# EasyEDA Pro project stm32手表_2024-06-10.epro, schematic STM32手表v2.0
Create Date: 2024-03-20; Page Name: P1; Project Name: stm32手表; Schematic Name: Schematic1; Update Date: 2024-06-09; Company: 嘉立创EDA; Page Size: A4; Version: V1.0
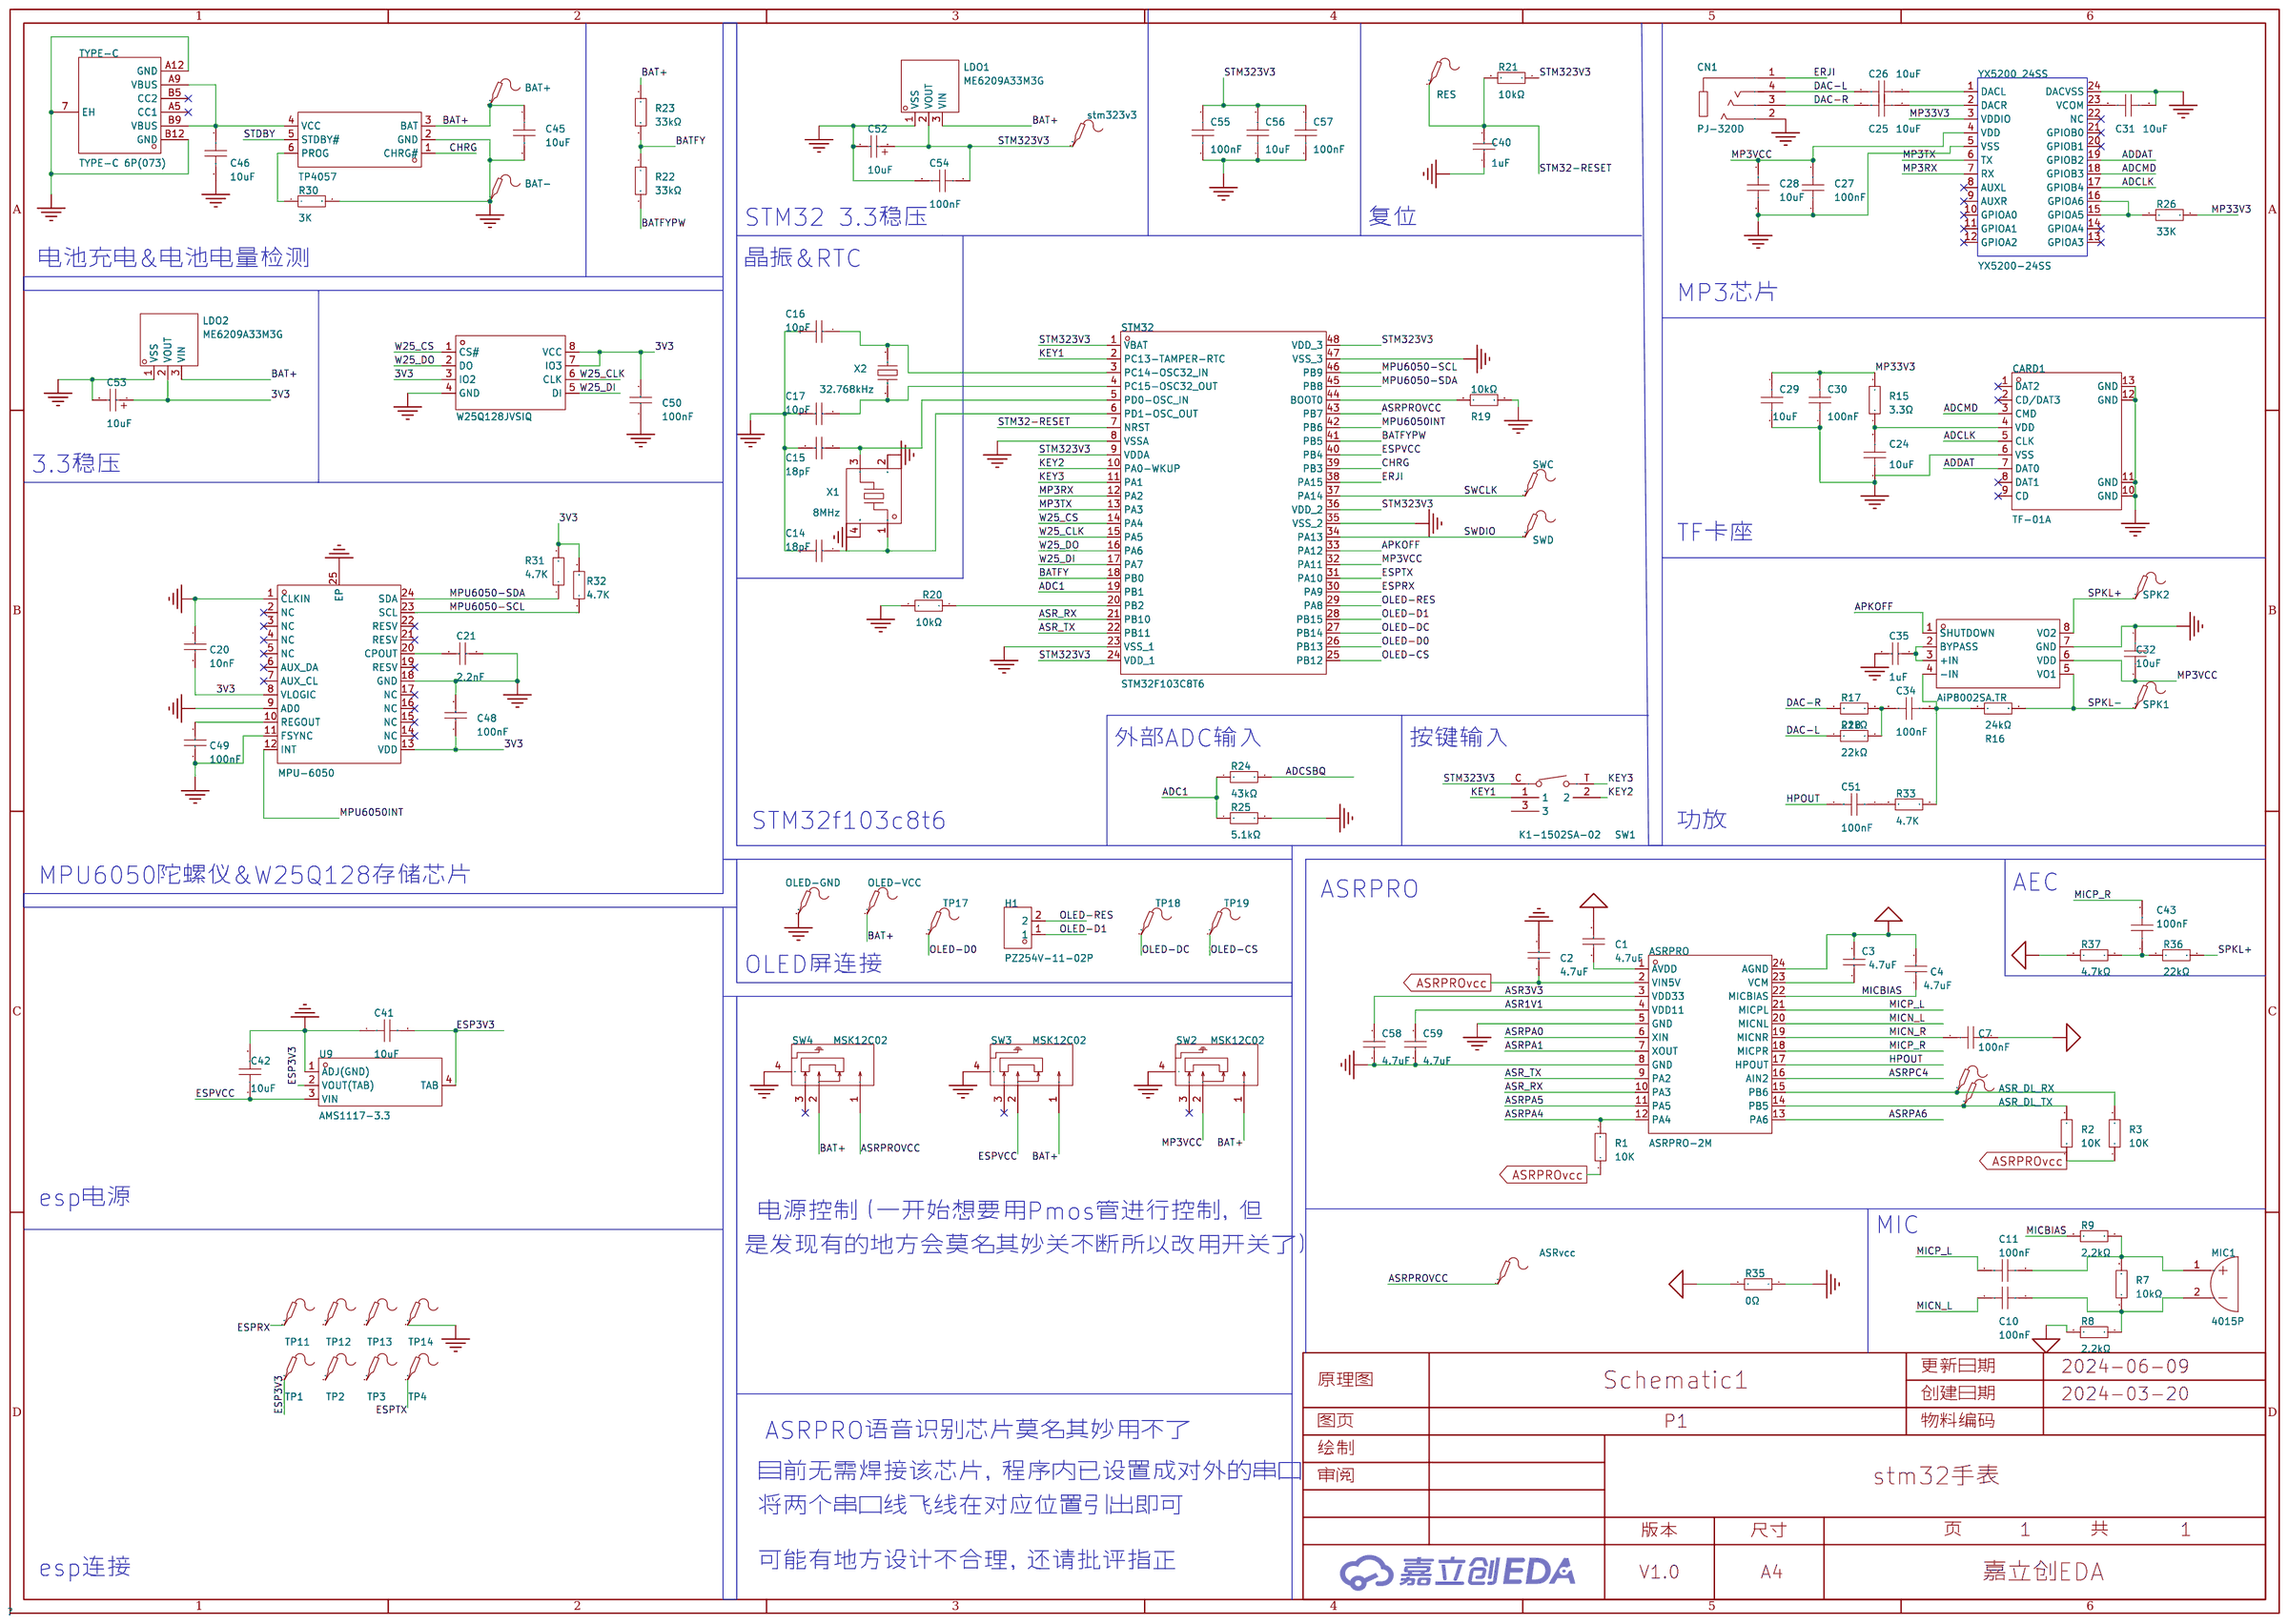
[diagram p0: schematic sheet]

## Parts
8002A  AiP8002SA.TR  [SOP-8_L4.9-W3.9-P1.27-LS6.0-BL]
ASR_DL_RX  -  [Test-Point-0.5mm]
ASR_DL_TX  -  [Test-Point-0.5mm]
ASRPRO  ASRPRO-2M  [SSOP-24_L8.7-W3.9-P0.64-LS6.0-BL-1]
ASRvcc  -  [Test-Point-0.5mm]
BAT+  -  [Test-Point-0.5mm]
BAT-  -  [Test-Point-0.5mm]
C1  4.7uF  [C0603]
C2  4.7uF  [C0603]
C3  4.7uF  [C0603]
C4  4.7uF  [C0603]
C7  100nF  [C0603]
C10  100nF  [C0603]
C11  100nF  [C0603]
C14  18pF  [C0603]
C15  18pF  [C0603]
C16  10pF  [C0603]
C17  10pF  [C0603]
C20  10nF  [C0603]
C21  2.2nF  [C0603]
C24  10uF  [C0603]
C25  10uF  [C0603]
C26  10uF  [C0603]
C27  100nF  [C0603]
C28  10uF  [C0603]
C29  10uF  [C0603]
C30  100nF  [C0603]
C31  10uF  [C0603]
C32  10uF  [C0603]
C34  100nF  [C0603]
C35  1uF  [C0603]
C40  1uF  [C0603]
C41  10uF  [C0603]
C42  10uF  [C0603]
C43  100nF  [C0603]
C45  10uF  [C0603]
C46  10uF  [C0603]
C48  100nF  [C0603]
C49  100nF  [C0603]
C50  100nF  [C0603]
C51  100nF  [C0603]
C52  10uF  [CASE-A_3216]
C53  10uF  [CASE-A_3216]
C54  100nF  [C0603]
C55  100nF  [C0603]
C56  10uF  [C0603]
C57  100nF  [C0603]
C58  4.7uF  [C0603]
C59  4.7uF  [C0603]
CARD1  TF-01A  [TF-SMD_TF-02]
CN1  PJ-320D  [AUDIO-SMD_PJ-320D]
H1  PZ254V-11-02P  [HDR-TH_2P-P2.54-V-M]
LDO1  ME6209A33M3G  [SOT-23-3_L2.9-W1.6-P1.90-LS2.8-BR]
LDO2  ME6209A33M3G  [SOT-23-3_L2.9-W1.6-P1.90-LS2.8-BR]
MIC1  4015P  [MIC-TH_BD4.0-P1.40-D0.4-L-FD]
MPU-6050  MPU-6050  [QFN-24_L4.0-W4.0-P0.50-BL-EP2.7]
OLED-GND  -  [Test-Point-0.5mm]
OLED-VCC  -  [Test-Point-0.5mm]
R1  10K  [R0603]
R2  10K  [R0603]
R3  10K  [R0603]
R7  10kΩ  [R0603]
R8  2.2kΩ  [R0603]
R9  2.2kΩ  [R0603]
R15  3.3Ω  [R0603]
R16  24kΩ  [R0603]
R17  22kΩ  [R0603]
R18  22kΩ  [R0603]
R19  10kΩ  [R0603]
R20  10kΩ  [R0603]
R21  10kΩ  [R0603]
R22  33kΩ  [R0603]
R23  33kΩ  [R0603]
R24  43kΩ  [R0603]
R25  5.1kΩ  [R0603]
R26  33K  [R0603]
R30  3K  [R0603]
R31  4.7K  [R0603]
R32  4.7K  [R0603]
R33  4.7K  [R0603]
R35  0Ω  [R0402]
R36  22kΩ  [R0603]
R37  4.7kΩ  [R0603]
RES  -  [Test-Point-0.5mm]
SPK1  -  [Test-Point-0.5mm]
SPK2  -  [Test-Point-0.5mm]
STM32  STM32F103C8T6  [LQFP-48_L7.0-W7.0-P0.50-LS9.0-BL]
stm323v3  -  [Test-Point-0.5mm]
SW1  K1-1502SA-02  [KEY-SMD_K1-1502SA-02]
SW2  MSK12C02  [SW-TH_MSK12C02]
SW3  MSK12C02  [SW-TH_MSK12C02]
SW4  MSK12C02  [SW-TH_MSK12C02]
SWC  -  [Test-Point-0.5mm]
SWD  -  [Test-Point-0.5mm]
TP1  -  [Test-Point-0.5mm]
TP2  -  [Test-Point-0.5mm]
TP3  -  [Test-Point-0.5mm]
TP4  -  [Test-Point-0.5mm]
TP11  -  [Test-Point-0.5mm]
TP12  -  [Test-Point-0.5mm]
TP13  -  [Test-Point-0.5mm]
TP14  -  [Test-Point-0.5mm]
TP17  -  [Test-Point-0.5mm]
TP18  -  [Test-Point-0.5mm]
TP19  -  [Test-Point-0.5mm]
TP4057  TP4057  [SOT-23-6_L2.9-W1.6-P0.95-LS2.8-BR]
TYPE-C  TYPE-C 6P(073)  [TYPE-C-SMD_TYPE-C-6P]
U9  AMS1117-3.3  [SOT-223-4_L6.5-W3.5-P2.30-LS7.0-BR]
W25Q128  W25Q128JVSIQ  [SOIC-8_L5.3-W5.3-P1.27-LS8.0-BL]
X1  8MHz  [CRYSTAL-SMD_4P-L3.2-W2.5-BL]
X2  32.768kHz  [OSC-SMD_L3.2-W1.5]
YX5200_24SS  YX5200-24SS  [SSOP-24_L8.2-W5.3-P0.65-LS7.8-BL]

## Library data of the parts
8002A = AiP8002SA.TR: LCSC Part Name: 带关断模式的2W音频功率放大器; Supplier Part: C5162257; Manufacturer: I-CORE(中微爱芯); Supplier Footprint: SOP-8; JLCPCB Part Class: 扩展库; Datasheet: https://atta.szlcsc.com/upload/public/pdf/source/20220915/34DFDD2E4A18841713C467EC6A02930C.pdf; Supplier: LCSC
ASR_DL_RX ASR_DL_TX ASRvcc BAT+ BAT- OLED-GND OLED-VCC RES SPK1 SPK2 stm323v3 SWC SWD TP1-TP4 TP11-TP14 TP17-TP19 = Test-Point: Test Point 测试点
ASRPRO = ASRPRO-2M: Supplier Part: C9900044331; Supplier Footprint: SSOP24-0.635-8.65X4MM; JLCPCB Part Class: 扩展库; Supplier: LCSC
C1-C4 C58 C59 = CL10A475KP8NNNC: 容值:4.7uF;精度:±10%;额定电压:10V;材质(温度系数):X5R;; LCSC Part Name: 4.7uF ±10% 10V; Supplier Part: C1705; Manufacturer: SAMSUNG(三星); Supplier Footprint: 0603; JLCPCB Part Class: 扩展库; Datasheet: https://atta.szlcsc.com/upload/public/pdf/source/20160218/1457707763339.pdf; Supplier: LCSC; Tolerance: ±10%; Voltage Rated: 10V; Temperature Coefficient: X5R
C7 C10 C11 C27 C30 C34 C43 C51 = CC0603KRX7R9BB104: 容值:100nF;精度:±10%;额定电压:50V;材质(温度系数):X7R;; LCSC Part Name: 100nF ±10% 50V; Supplier Part: C14663; Manufacturer: YAGEO(国巨); Supplier Footprint: 0603; JLCPCB Part Class: 基础库; Datasheet: https://atta.szlcsc.com/upload/public/pdf/source/20180910/C282072_33301C7F631E79921B82A8DAC6BCC5B3.pdf; Supplier: LCSC; Tolerance: ±10%; Voltage Rated: 50V; Temperature Coefficient: X7R
C14 C15 = 0402CG220J500NT: 容值:22pF;精度:±5%;额定电压:50V;材质(温度系数):C0G;; LCSC Part Name: 22pF ±5% 50V; Supplier Part: C1555; Manufacturer: FH(风华); Supplier Footprint: 0402; JLCPCB Part Class: 基础库; Datasheet: https://atta.szlcsc.com/upload/public/pdf/source/20200305/C486355_26A10D38EF8C2A5C37091D0039909270.pdf; Supplier: LCSC; Tolerance: ±5%; Voltage Rated: 50V; Temperature Coefficient: C0G
C16 C17 = CC0603JRNPO9BN220: 容值:22pF;精度:±5%;额定电压:50V;材质(温度系数):NP0;; LCSC Part Name: 22pF ±5% 50V; Supplier Part: C105620; Manufacturer: YAGEO(国巨); Supplier Footprint: 0603; JLCPCB Part Class: 扩展库; Datasheet: https://atta.szlcsc.com/upload/public/pdf/source/20170505/1493957838062.pdf; Supplier: LCSC; Tolerance: ±5%; Voltage Rated: 50V; Temperature Coefficient: NP0
C20 C48-C50 = CC0603KRX7R9BB103: 容值:10nF;精度:±10%;额定电压:50V;材质(温度系数):X7R;; LCSC Part Name: 10nF ±10% 50V; Supplier Part: C100042; Manufacturer: YAGEO(国巨); Supplier Footprint: 0603; JLCPCB Part Class: 扩展库; Datasheet: https://atta.szlcsc.com/upload/public/pdf/source/20181008/C309510_22F155564471FAF6A489F7D68F34234E.pdf; Supplier: LCSC; Tolerance: ±10%; Voltage Rated: 50V; Temperature Coefficient: X7R
C21 = 0603B222K500NT: 容值:2.2nF;精度:±10%;额定电压:50V;材质(温度系数):X7R;; LCSC Part Name: 2.2nF ±10% 50V; Supplier Part: C1604; Manufacturer: FH(风华); Supplier Footprint: 0603; JLCPCB Part Class: 基础库; Datasheet: https://atta.szlcsc.com/upload/public/pdf/source/20200305/C486355_26A10D38EF8C2A5C37091D0039909270.pdf; Supplier: LCSC; Tolerance: ±10%; Voltage Rated: 50V; Temperature Coefficient: X7R
C24-C26 C28 C29 C31 C32 C41 C42 C45 C46 = CL10A106MQ8NNNC: 容值:10uF;精度:±20%;额定电压:6.3V;材质(温度系数):X5R;; LCSC Part Name: 10uF ±20% 6.3V; Supplier Part: C1691; Manufacturer: SAMSUNG(三星); Supplier Footprint: 0603; JLCPCB Part Class: 扩展库; Datasheet: https://atta.szlcsc.com/upload/public/pdf/source/20160218/1457707763339.pdf; Supplier: LCSC; Tolerance: ±20%; Voltage Rated: 6.3V; Temperature Coefficient: X5R
C35 C40 = CL10A105KB8NNNC: 容值:1uF;精度:±10%;额定电压:50V;材质(温度系数):X5R;; LCSC Part Name: 1uF ±10% 50V; Supplier Part: C15849; Manufacturer: SAMSUNG(三星); Supplier Footprint: 0603; JLCPCB Part Class: 基础库; Datasheet: https://atta.szlcsc.com/upload/public/pdf/source/20160218/1457707763339.pdf; Supplier: LCSC; Tolerance: ±10%; Voltage Rated: 50V; Temperature Coefficient: X5R
C52 C53 = TAJA106K010RNJ: 容值:10uF;精度:±10%;额定电压:10V;等效串联电阻:3Ω@100kHz;; LCSC Part Name: 10uF ±10% 10V; Supplier Part: C7177; Manufacturer: Kyocera AVX; Supplier Footprint: CASE-A-3216; JLCPCB Part Class: 扩展库; Datasheet: https://atta.szlcsc.com/upload/public/pdf/source/20160107/1457707750344.pdf; Supplier: LCSC; Tolerance: ±10%; Rated Voltage: 10V; Equivalent Series Resistance(ESR): 3Ω@100kHz; Operating Temperature: -55℃~+125℃
C54-C57 = CAP_0603: Supplier Footprint: 0603
CARD1 = TF-01A_C2889258: 卡连接方式:自弹式;卡类型:MicroSD卡(TF卡);连接器类型:卡座;本体最大高度:2mm;工作温度范围:-;; LCSC Part Name: 自弹式 MicroSD卡(TF卡) 卡座; Supplier Part: C2889258; Manufacturer: Yuandi(元迪); Supplier Footprint: SMD; JLCPCB Part Class: 扩展库; Datasheet: https://atta.szlcsc.com/upload/public/pdf/source/20210830/44259D2B93BF4B637A446EF1520C4989.pdf; Supplier: LCSC; Card Connection Mode: 自弹式; Card Type: MicroSD卡(TF卡); Connector Type: 卡座; Maximum Body Height: 2mm
CN1 = PJ-320D_C431535: 连接器类型:3.5mm耳机座;额定电流:300mA;额定电压:50V;工作温度范围:-16℃~+65℃;; LCSC Part Name: 3.5mm耳机座; Supplier Part: C431535; Manufacturer: SHOU HAN(首韩); Supplier Footprint: SMD; JLCPCB Part Class: 扩展库; Datasheet: https://atta.szlcsc.com/upload/public/pdf/source/20190925/C431535_8B274506621F6117FB020BF07A197848.pdf; Supplier: LCSC; Connector Type: 3.5mm耳机座; Current Rating (Max): 300mA; Voltage Rating (Max): 50V; Operating Temperature Range: -16℃~+65℃
H1 = PZ254V-11-02P: 插针结构:1x2P;间距:2.54mm;行距:-;圆针/方针:方针;安装类型:直插;排数:单排;总PIN位数:2P;额定电流:-;额定电压:-;配合针长度:6mm;塑高:2.5mm;端接针长度:3mm;触头材质:黄铜;触头镀层:-;工作温度范围:-40℃~+105℃;颜色:黑色;; LCSC Part Name: 间距:2.54mm 1x2P 直插 方针; Supplier Part: C492401; Manufacturer: XFCN(兴飞); Supplier Footprint: 插件,P=2.54mm; JLCPCB Part Class: 扩展库; Datasheet: https://atta.szlcsc.com/upload/public/pdf/source/20200309/C492401_A812433581A9B211A7FFA413ADDFF0E5.pdf; Supplier: LCSC; Pin Structure: 1x2P; Pitch: 2.54mm; Circluar Pins/Square Pins: 方针; Mounting Type: 直插; Number of Rows: 单排; Number of Pins: 2P; Length of Mating Pin: 6mm; Insulation Height: 2.5mm; Length of End Connection Pin: 3mm; Contact Material: 黄铜; Operating Temperature Range: -40℃~+105℃; Color: 黑色
LDO1 LDO2 = ME6209A33M3G: 输出类型:固定;最大输入电压:18V;输出电压:3.3V;最大输出电流:250mA;电源纹波抑制比(PSRR):-;输出极性:正极;; LCSC Part Name: 输入18V 输出3.3V 250mA; Supplier Part: C83508; Manufacturer: MICRONE(南京微盟); Supplier Footprint: SOT-23-3L; JLCPCB Part Class: 扩展库; Datasheet: https://atta.szlcsc.com/upload/public/pdf/source/20161212/1481539101152.pdf; Supplier: LCSC; Output Type: 固定; Maximum Input Voltage: 18V; Output Voltage: 3.3V; MAX Output Current: 250mA; Dropout Voltage: 80mV@(40mA); Output Polarity: 正极; Number of Outputs: 1
MIC1 = GMI4015P-2C-42db: LCSC Part Name: 全指向双电容φ4.0*1.5mm 1.5V-10V 灵敏度-42dB 低阻抗; Supplier Part: C233292; Manufacturer: INGHAi(赢海); Supplier Footprint: 插件,D=4mm; JLCPCB Part Class: 扩展库; Datasheet: https://atta.szlcsc.com/upload/public/pdf/source/20180613/C233304_D8FE5A0D9DC594913DFA1A209BBF4764.pdf; Supplier: LCSC
MPU-6050 = MPU-6050: 传感器类型:加速度计陀螺仪;; Supplier Part: C24112; Manufacturer: TDK InvenSense(应美盛); Supplier Footprint: QFN-24-EP(4x4); JLCPCB Part Class: 扩展库; Datasheet: https://atta.szlcsc.com/upload/public/pdf/source/20140425/1457707046159.pdf; Supplier: LCSC; Sensor Type: 加速度计陀螺仪; Operating Temperature: -40℃~+85℃
R1-R3 R26 R30-R33 = Res_0603: Supplier Footprint: 0603
R7 R21 R24 = 0603WAF1002T5E: 电阻类型:厚膜电阻;阻值:10kΩ;精度:±1%;功率:100mW;最大工作电压:75V;温度系数:±100ppm/℃;; LCSC Part Name: 厚膜电阻 10kΩ ±1% 100mW; Supplier Part: C25804; Manufacturer: UNI-ROYAL(厚声); Supplier Footprint: 0603; JLCPCB Part Class: 基础库; Datasheet: https://atta.szlcsc.com/upload/public/pdf/source/20200306/C422600_1E6D84923E4A46A82E41ADD87F860B5C.pdf; Supplier: LCSC; Type: 厚膜电阻; Tolerance: ±1%; Power(Watts): 100mW; Overload Voltage (Max): 75V; Temperature Coefficient: ±100ppm/℃; Operating Temperature Range: -55℃~+155℃
R8 R9 R37 = 0603WAF2201T5E: 电阻类型:厚膜电阻;阻值:2.2kΩ;精度:±1%;功率:100mW;最大工作电压:75V;温度系数:±100ppm/℃;; LCSC Part Name: 2.2kΩ ±1% 100mW 厚膜电阻; Supplier Part: C4190; Manufacturer: UNI-ROYAL(厚声); Supplier Footprint: 0603; JLCPCB Part Class: 基础库; Datasheet: https://atta.szlcsc.com/upload/public/pdf/source/20200306/C422600_1E6D84923E4A46A82E41ADD87F860B5C.pdf; Supplier: LCSC; Type: 厚膜电阻; Tolerance: ±1%; Power(Watts): 100mW; Overload Voltage (Max): 75V; Temperature Coefficient: ±100ppm/℃; Operating Temperature Range: -55℃~+155℃
R15 = 0603WAF470KT5E: 电阻类型:厚膜电阻;阻值:4.7Ω;精度:±1%;功率:100mW;最大工作电压:75V;温度系数:±400ppm/℃;; LCSC Part Name: 4.7Ω ±1% 100mW 厚膜电阻; Supplier Part: C23164; Manufacturer: UNI-ROYAL(厚声); Supplier Footprint: 0603; JLCPCB Part Class: 基础库; Datasheet: https://atta.szlcsc.com/upload/public/pdf/source/20200306/C422600_1E6D84923E4A46A82E41ADD87F860B5C.pdf; Supplier: LCSC; Type: 厚膜电阻; Tolerance: ±1%; Power(Watts): 100mW; Overload Voltage (Max): 75V; Temperature Coefficient: ±400ppm/℃; Operating Temperature Range: -55℃~+155℃
R16 = 0603WAF2402T5E: 电阻类型:厚膜电阻;阻值:24kΩ;精度:±1%;功率:100mW;最大工作电压:75V;温度系数:±100ppm/℃;; LCSC Part Name: 24kΩ ±1% 100mW 厚膜电阻; Supplier Part: C23352; Manufacturer: UNI-ROYAL(厚声); Supplier Footprint: 0603; JLCPCB Part Class: 基础库; Datasheet: https://atta.szlcsc.com/upload/public/pdf/source/20200306/C422600_1E6D84923E4A46A82E41ADD87F860B5C.pdf; Supplier: LCSC; Type: 厚膜电阻; Tolerance: ±1%; Power(Watts): 100mW; Overload Voltage (Max): 75V; Temperature Coefficient: ±100ppm/℃; Operating Temperature Range: -55℃~+155℃
R17 R18 R36 = 0603WAF2202T5E: 电阻类型:厚膜电阻;阻值:22kΩ;精度:±1%;功率:100mW;最大工作电压:75V;温度系数:±100ppm/℃;; LCSC Part Name: 22kΩ ±1% 100mW 厚膜电阻; Supplier Part: C31850; Manufacturer: UNI-ROYAL(厚声); Supplier Footprint: 0603; JLCPCB Part Class: 基础库; Datasheet: https://atta.szlcsc.com/upload/public/pdf/source/20200306/C422600_1E6D84923E4A46A82E41ADD87F860B5C.pdf; Supplier: LCSC; Type: 厚膜电阻; Tolerance: ±1%; Power(Watts): 100mW; Overload Voltage (Max): 75V; Temperature Coefficient: ±100ppm/℃; Operating Temperature Range: -55℃~+155℃
R19 R20 = RC0603FR-07100KL: 电阻类型:厚膜电阻;阻值:100kΩ;精度:±1%;功率:100mW;最大工作电压:75V;温度系数:±100ppm/℃;; LCSC Part Name: 厚膜电阻 100kΩ ±1% 100mW; Supplier Part: C14675; Manufacturer: YAGEO(国巨); Supplier Footprint: 0603; JLCPCB Part Class: 扩展库; Datasheet: https://atta.szlcsc.com/upload/public/pdf/source/20140324/1457707028752.pdf; Supplier: LCSC; Type: 厚膜电阻; Tolerance: ±1%; Power(Watts): 100mW; Overload Voltage (Max): 75V; Temperature Coefficient: ±100ppm/℃; Operating Temperature Range: -55℃~+155℃
R22 R23 = 0603WAF4701T5E: 电阻类型:厚膜电阻;阻值:4.7kΩ;精度:±1%;功率:100mW;最大工作电压:75V;温度系数:±100ppm/℃;; LCSC Part Name: 4.7kΩ ±1% 100mW 厚膜电阻; Supplier Part: C23162; Manufacturer: UNI-ROYAL(厚声); Supplier Footprint: 0603; JLCPCB Part Class: 基础库; Datasheet: https://atta.szlcsc.com/upload/public/pdf/source/20200306/C422600_1E6D84923E4A46A82E41ADD87F860B5C.pdf; Supplier: LCSC; Type: 厚膜电阻; Tolerance: ±1%; Power(Watts): 100mW; Overload Voltage (Max): 75V; Temperature Coefficient: ±100ppm/℃; Operating Temperature Range: -55℃~+155℃
R25 = 0603WAF1801T5E: 电阻类型:厚膜电阻;阻值:1.8kΩ;精度:±1%;功率:100mW;最大工作电压:75V;温度系数:±100ppm/℃;; LCSC Part Name: 1.8kΩ ±1% 100mW 厚膜电阻; Supplier Part: C4177; Manufacturer: UNI-ROYAL(厚声); Supplier Footprint: 0603; JLCPCB Part Class: 基础库; Datasheet: https://atta.szlcsc.com/upload/public/pdf/source/20200306/C422600_1E6D84923E4A46A82E41ADD87F860B5C.pdf; Supplier: LCSC; Type: 厚膜电阻; Tolerance: ±1%; Power(Watts): 100mW; Overload Voltage (Max): 75V; Temperature Coefficient: ±100ppm/℃; Operating Temperature Range: -55℃~+155℃
R35 = 0402WGJ0000TCE: 电阻类型:厚膜电阻;阻值:0Ω;精度:±5%;功率:62.5mW;最大工作电压:50V;; LCSC Part Name: 0Ω ±5% 62.5mW 厚膜电阻; Supplier Part: C21376; Manufacturer: UNI-ROYAL(厚声); Supplier Footprint: 0402; JLCPCB Part Class: 扩展库; Datasheet: https://atta.szlcsc.com/upload/public/pdf/source/20200306/C422600_1E6D84923E4A46A82E41ADD87F860B5C.pdf; Supplier: LCSC; Type: 厚膜电阻; Tolerance: ±5%; Power(Watts): 62.5mW; Overload Voltage (Max): 50V; Operating Temperature Range: -55℃~+155℃
STM32 = STM32F103C8T6: CPU内核:CM3;程序存储容量:64KB;RAM总容量:20KB;GPIO端口数量:37;工作电压范围:2V~3.6V;CPU最大主频:72MHz;程序存储器类型:FLASH;; LCSC Part Name: STM32F103C8T6 MSL=3; Supplier Part: C8734; Manufacturer: ST(意法半导体); Supplier Footprint: LQFP-48(7x7); JLCPCB Part Class: 扩展库; Datasheet: https://atta.szlcsc.com/upload/public/pdf/source/20220812/8363ACEC51AD55ECEB84799464F7CB85.pdf; Supplier: LCSC; CPU Core: CM3; Program Storage Size: 64KB; RAM Size: 20KB; GPIO Ports Number: 37; Operating Voltage Range: 2V~3.6V; CPU Maximum Speed: 72MHz; Program Memory Type: FLASH; Operating Temperature Range: -40℃~+85℃; ADC (Bit): 12bit; Universal Serial Bus: 有; Peripheral/Function: 看门狗；DMA；看门狗；片载温度传感器; Watchdog: 有; Infrared Data Association: 有; Low-Voltage Detect: 有; Direct Memory Access: 有; Internal Oscillator: 有
SW1 = K1-1502SA-02: LCSC Part Name: 上中下按键三向拨轮开关 11.8mm*11.7mm; Supplier Part: C128929; Manufacturer: 韩国韩荣; Supplier Footprint: SMD-5P,11.7x11.8mm; JLCPCB Part Class: 扩展库; Datasheet: https://atta.szlcsc.com/upload/public/pdf/source/20210810/6E4D76E797EC1584D0EB8D60F77D41D6.pdf; Supplier: LCSC
SW2-SW4 = MSK12C02: 电路结构:单刀双掷;安装方式:卧贴;开关颜色:-;额定电流(DC):50mA;额定电压(DC):12V;额定电流(AC):-;额定电压(AC):-;机械寿命:1万次;; LCSC Part Name: 两档侧拨贴片 7脚 滑动开关; Supplier Part: C431540; Manufacturer: SHOU HAN(首韩); Supplier Footprint: SMD; JLCPCB Part Class: 扩展库; Datasheet: https://atta.szlcsc.com/upload/public/pdf/source/20190925/C431540_89155AEF0758B9AD1B2D805F83FB12E3.pdf; Supplier: LCSC; Circuit: 单刀双掷; Pin Style: SMD接片; Switch Length: 8mm; Switch Width: 2.8mm; Switch Height: 1.4mm; Mounting Style: 卧贴; Current Rating (DC): 50mA; Voltage Rating (DC): 12V; Mechanical Life: 1万次; Operating Temperature: -20℃~+70℃
TP4057 = TP4057: 电源电压:6.5V;最大充电电流:500mA;电池类型:锂离子/聚合物;电池节数:1;; Supplier Part: C725791; Manufacturer: UMW(友台半导体); Supplier Footprint: SOT-23-6; JLCPCB Part Class: 扩展库; Datasheet: https://atta.szlcsc.com/upload/public/pdf/source/20231109/7FB39B0490CD1514A6792371FCA0BB30.pdf; Supplier: LCSC; Supply Voltage: 6.5V; Maximum Charge Current: 500mA; Type of Battery: 锂离子/聚合物; Number of Cells: 1; Operating Temperature: -40℃~+85℃
TYPE-C = TYPE-C 6P(073): 连接器类型:Type-C;标准:-;公母:母;端口数量:1;触点数量:6P;安装方式:卧贴;额定电流 - 电源:5A;工作温度范围:-25℃~+85℃;; LCSC Part Name: Type-C 母 卧贴; Supplier Part: C668623; Manufacturer: SHOU HAN(首韩); Supplier Footprint: SMD; JLCPCB Part Class: 扩展库; Datasheet: https://atta.szlcsc.com/upload/public/pdf/source/20200618/C668623_A4B260DED7AC1949BAC6AE39E9F4CD80.pdf; Supplier: LCSC; Connector Type: Type-C; Gender: 母; Number of Ports: 1; Number of Contacts: 6P; Mounting Style: 卧贴; Current Rating - Power (Max): 5A; Operating Temperature Range: -25℃~+85℃
U9 = AMS1117-3.3_C347222: 输出类型:固定;最大输入电压:12V;输出电压:3.3V;最大输出电流:1A;电源纹波抑制比(PSRR):60dB@(120Hz);输出极性:正极;; LCSC Part Name: 输出:3.3V 电流:1A 耐压:12V; Supplier Part: C347222; Manufacturer: UMW(友台半导体); Supplier Footprint: SOT-223; JLCPCB Part Class: 扩展库; Datasheet: https://atta.szlcsc.com/upload/public/pdf/source/20231109/155D79A26D9DB04352555A58D5969DC8.pdf; Supplier: LCSC; Output Type: 固定; Maximum Input Voltage: 12V; Output Voltage: 3.3V; MAX Output Current: 1A; Power Supply Rejection Ratio (PSRR): 60dB@(120Hz); Dropout Voltage: 1.3V@(1A); Output Polarity: 正极; Number of Outputs: 1
W25Q128 = W25Q128JVSIQ: 接口类型:-;存储容量:128Mbit;时钟频率(fc):-;; LCSC Part Name: W25Q128JVSIQ 编带; Supplier Part: C97521; Manufacturer: WINBOND(华邦); Supplier Footprint: SOIC-8-208mil; JLCPCB Part Class: 基础库; Datasheet: https://atta.szlcsc.com/upload/public/pdf/source/20170316/1489627409956.pdf; Supplier: LCSC; Memory Size: 128Mbit
X1 = X32258MSB4SI: 晶振类型:贴片晶振;频率:8MHz;常温频差:±10ppm;外接负载电容:20pF;频率稳定度(全温):±20ppm;; LCSC Part Name: 8MHz ±10ppm 20pF; Supplier Part: C2682774; Manufacturer: YXC(扬兴晶振); Supplier Footprint: SMD3225-4P; JLCPCB Part Class: 扩展库; Datasheet: https://atta.szlcsc.com/upload/public/pdf/source/20240329/19D5F850207469550BEB00D7DFEDBC7A.pdf; Supplier: LCSC; Crystal Type: 贴片晶振; Normal temperature Frequency Tolerance: ±10ppm; External load capacitor: 20pF; Frequency Stability(Full temperature range): ±20ppm; Operating Temperature: -40℃~+85℃
X2 = X321532768KGD2SI: 晶振类型:贴片晶振;频率:32.768kHz;常温频差:±20ppm;外接负载电容:12.5pF;频率稳定度(全温):-;; LCSC Part Name: 32.768kHz ±20ppm 12.5pF; Supplier Part: C620155; Manufacturer: YXC(扬兴晶振); Supplier Footprint: SMD3215-2P; JLCPCB Part Class: 扩展库; Datasheet: https://atta.szlcsc.com/upload/public/pdf/source/20240329/3A7650FD985DD0DE85694D3785AB4916.pdf; Supplier: LCSC; Crystal Type: 贴片晶振; Normal temperature Frequency Tolerance: ±20ppm; External load capacitor: 12.5pF; Operating Temperature: -40℃~+85℃
YX5200_24SS = YX5200-24SS: Manufacturer: 广州悦欣电子科技; Supplier Footprint: SSOP-24_L8.7-W3.9-P0.635-LS6.0-BL

## Nets
3V3: C20.1 C48.1 C50.2 C53.1 LDO2.2(VOUT) MPU-6050.8(VLOGIC) MPU-6050.13(VDD) R31.2 R32.2 W25Q128.3(IO2) W25Q128.7(IO3) W25Q128.8(VCC)
GND: 8002A.7(GND) ASRPRO.5(GND) ASRPRO.8(GND) BAT-.1 C2.2 C14.2 C15.2 C16.2 C17.2 C20.2 C21.2 C24.1 C27.1 C28.2 C29.2 C30.1 C31.1 C32.1 C35.1 C40.1 C41.1 C42.2 C45.2 C46.2 C48.2 C49.1 C50.1 C52.2 C53.2 C54.1 C55.1 C56.1 C57.1 C58.1 C59.1 CARD1.6(VSS) CARD1.10(GND) CARD1.11(GND) CARD1.12(GND) CARD1.13(GND) CN1.2 LDO1.1(VSS) LDO2.1(VSS) MPU-6050.1(CLKIN) MPU-6050.9(AD0) MPU-6050.11(FSYNC) MPU-6050.18(GND) MPU-6050.25(EP) OLED-GND.1 R19.1 R20.2 R25.2 R30.2 R35.1 STM32.8(VSSA) STM32.23(VSS_1) STM32.35(VSS_2) STM32.47(VSS_3) SW2.4 SW3.4 SW4.4 TP14.1 TP4057.2(GND) TYPE-C.7(EH) TYPE-C.A12(GND) TYPE-C.B12(GND) U9.1(ADJ(GND)) W25Q128.4(GND) X1.2(GND) X1.4(GND) YX5200_24SS.5(VSS) YX5200_24SS.24(DACVSS)
ADC1: R24.1 R25.1 STM32.19(PB1)
ADCLK: CARD1.5(CLK) YX5200_24SS.17(GPIOB4)
ADCMD: CARD1.3(CMD) YX5200_24SS.18(GPIOB3)
ADCSBQ: R24.2
ADDAT: CARD1.7(DAT0) YX5200_24SS.19(GPIOB2)
APKOFF: 8002A.1(SHUTDOWN) STM32.33(PA12)
ASR1V1: ASRPRO.4(VDD11) C59.2
ASR3V3: ASRPRO.3(VDD33) C58.2
ASR_RX: ASRPRO.10(PA3) STM32.21(PB10)
ASR_TX: ASRPRO.9(PA2) STM32.22(PB11)
ASRPA0: ASRPRO.6(XIN)
ASRPA1: ASRPRO.7(XOUT)
ASRPA4: ASRPRO.12(PA4) R1.2
ASRPA5: ASRPRO.11(PA5)
ASRPA6: ASRPRO.13(PA6)
ASRPC4: ASRPRO.16(AIN2)
ASRPRO_AGND: ASRPRO.24(AGND) C1.2 C3.2 C4.2 C7.2 R8.2 R35.2 R37.2
ASRPROVCC: ASRvcc.1 STM32.43(PB7) SW4.1
ASRPROvcc: ASRPRO.2(VIN5V) C2.1 R1.1 R2.1 R3.1
BAT+: BAT+.1 C45.1 LDO1.3(VIN) LDO2.3(VIN) OLED-VCC.1 R23.1 SW2.1 SW3.1 SW4.2 TP4057.3(BAT)
BATFY: R22.1 R23.2 STM32.18(PB0)
BATFYPW: R22.2 STM32.41(PB5)
CHRG: STM32.39(PB3) TP4057.1(CHRG#)
DAC-L: C26.2 CN1.4 R18.1
DAC-R: C25.2 CN1.3 R17.1
ERJI: CN1.1 STM32.38(PA15)
ESP3V3: C41.2 TP1.1 U9.2(VOUT(TAB)) U9.4(TAB)
ESPRX: STM32.30(PA9) TP11.1
ESPTX: STM32.31(PA10) TP4.1
ESPVCC: C42.1 STM32.40(PB4) SW3.2 U9.3(VIN)
HPOUT: ASRPRO.17(HPOUT) C51.2
KEY1: STM32.2(PC13-TAMPER-RTC) SW1.1
KEY2: STM32.10(PA0-WKUP) SW1.2
KEY3: STM32.11(PA1) SW1.T
MICBIAS: ASRPRO.22(MICBIAS) C4.1 R9.2
MICN_L: ASRPRO.20(MICNL) C10.2
MICN_R: ASRPRO.19(MICNR) C7.1
MICP_L: ASRPRO.21(MICPL) C11.2
MICP_R: ASRPRO.18(MICPR) C43.2
MP3RX: STM32.12(PA2) YX5200_24SS.7(RX)
MP3TX: STM32.13(PA3) YX5200_24SS.6(TX)
MP3VCC: 8002A.6(VDD) C27.2 C28.1 C32.2 STM32.32(PA11) SW2.2 YX5200_24SS.4(VDD)
MP33V3: C29.1 C30.2 R15.2 R26.2 YX5200_24SS.3(VDDIO)
MPU6050-SCL: MPU-6050.23(SCL) R32.1 STM32.46(PB9)
MPU6050-SDA: MPU-6050.24(SDA) R31.1 STM32.45(PB8)
MPU6050INT: MPU-6050.12(INT) STM32.42(PB6)
OLED-CS: STM32.25(PB12) TP19.1
OLED-D0: STM32.26(PB13) TP17.1
OLED-D1: H1.1 STM32.28(PB15)
OLED-DC: STM32.27(PB14) TP18.1
OLED-RES: H1.2 STM32.29(PA8)
SPKL+: 8002A.8(VO2) R36.2 SPK2.1
SPKL-: 8002A.5(VO1) R16.2 SPK1.1
STDBY: TP4057.5(STDBY#)
STM32-RESET: C40.2 R21.2 RES.1 STM32.7(NRST)
STM323V3: C52.1 C54.2 C55.2 C56.2 C57.2 LDO1.2(VOUT) R21.1 STM32.1(VBAT) STM32.9(VDDA) STM32.24(VDD_1) STM32.36(VDD_2) STM32.48(VDD_3) stm323v3.1 SW1.C
SWCLK: STM32.37(PA14) SWC.1
SWDIO: STM32.34(PA13) SWD.1
W25_CLK: STM32.15(PA5) W25Q128.6(CLK)
W25_CS: STM32.14(PA4) W25Q128.1(CS#)
W25_DI: STM32.17(PA7) W25Q128.5(DI)
W25_DO: STM32.16(PA6) W25Q128.2(DO)
$1N4061: ASRPRO.1(AVDD) C1.1
$1N4165: ASRPRO.23(VCM) C3.1
$1N4629: ASR_DL_RX.1 ASRPRO.15(PB6) R3.2
$1N4632: ASR_DL_TX.1 ASRPRO.14(PB5) R2.2
$1N8101: C16.1 STM32.3(PC14-OSC32_IN) X2.2
$1N8116: C17.1 STM32.4(PC15-OSC32_OUT) X2.1
$1N13001: C21.1 MPU-6050.20(CPOUT)
$1N18271: C24.2 CARD1.4(VDD) R15.1
$1N19813: C26.1 YX5200_24SS.1(DACL)
$1N21929: C25.1 YX5200_24SS.2(DACR)
$1N25250: C31.2 YX5200_24SS.23(VCOM)
$1N25574: 8002A.2(BYPASS) 8002A.3(+IN) C35.2
$1N25838: C34.2 R17.2 R18.2
$1N28732: R19.2 STM32.44(BOOT0)
$1N28884: R20.1 STM32.20(PB2)
$1N48134: R26.1 YX5200_24SS.15(GPIOA5) YX5200_24SS.16(GPIOA6)
$1N59995: C11.1 MIC1.1 R7.2 R9.1
$1N60004: C10.1 MIC1.2 R7.1 R8.1
$1N65824: C46.1 TP4057.4(VCC) TYPE-C.A9(VBUS) TYPE-C.B9(VBUS)
$1N68620: R30.1 TP4057.6(PROG)
$1N71742: C15.1 STM32.5(PD0-OSC_IN) X1.3
$1N71792: C14.1 STM32.6(PD1-OSC_OUT) X1.1
$1N75228: C49.2 MPU-6050.10(REGOUT)
$1N77970: C51.1 R33.2
$1N78232: C43.1 R36.1 R37.1
$1N78327: 8002A.4(-IN) C34.1 R16.1 R33.1

Not connected (* = marked no-connect by the designer): CARD1 1(DAT2)* 2(CD/DAT3)* 8(DAT1)* 9(CD)*; MPU-6050 2(NC)* 3(NC)* 4(NC)* 5(NC)* 6(AUX_DA)* 7(AUX_CL)* 14(NC)* 15(NC)* 16(NC)* 17(NC)* 19(RESV)* 21(RESV)* 22(RESV)*; SW1 3; SW2 3*; SW3 3*; SW4 3*; TP2 1; TP3 1; TP12 1; TP13 1; TYPE-C A5(CC1)* B5(CC2)*; YX5200_24SS 8(AUXL)* 9(AUXR)* 10(GPIOA0)* 11(GPIOA1)* 12(GPIOA2)* 13(GPIOA3)* 14(GPIOA4)* 20(GPIOB1)* 21(GPIOB0)* 22(NC)*

## Notes on the sheet
- STM32 3.3稳压
- 复位
- 电池充电&电池电量检测
- 晶振&RTC
- MP3芯片
- 3.3稳压
- TF卡座
- 外部ADC输入
- 按键输入
- STM32f103c8t6
- 功放
- MPU6050陀螺仪&W25Q128存储芯片
- ASRPRO
- AEC
- OLED屏连接
- esp电源
- 电源控制（一开始想要用Pmos管进行控制，但
- MIC
- 是发现有的地方会莫名其妙关不断所以改用开关了）
- ASRPRO语音识别芯片莫名其妙用不了
- 目前无需焊接该芯片，程序内已设置成对外的串口
- 将两个串口线飞线在对应位置引出即可
- esp连接
- 可能有地方设计不合理，还请批评指正
